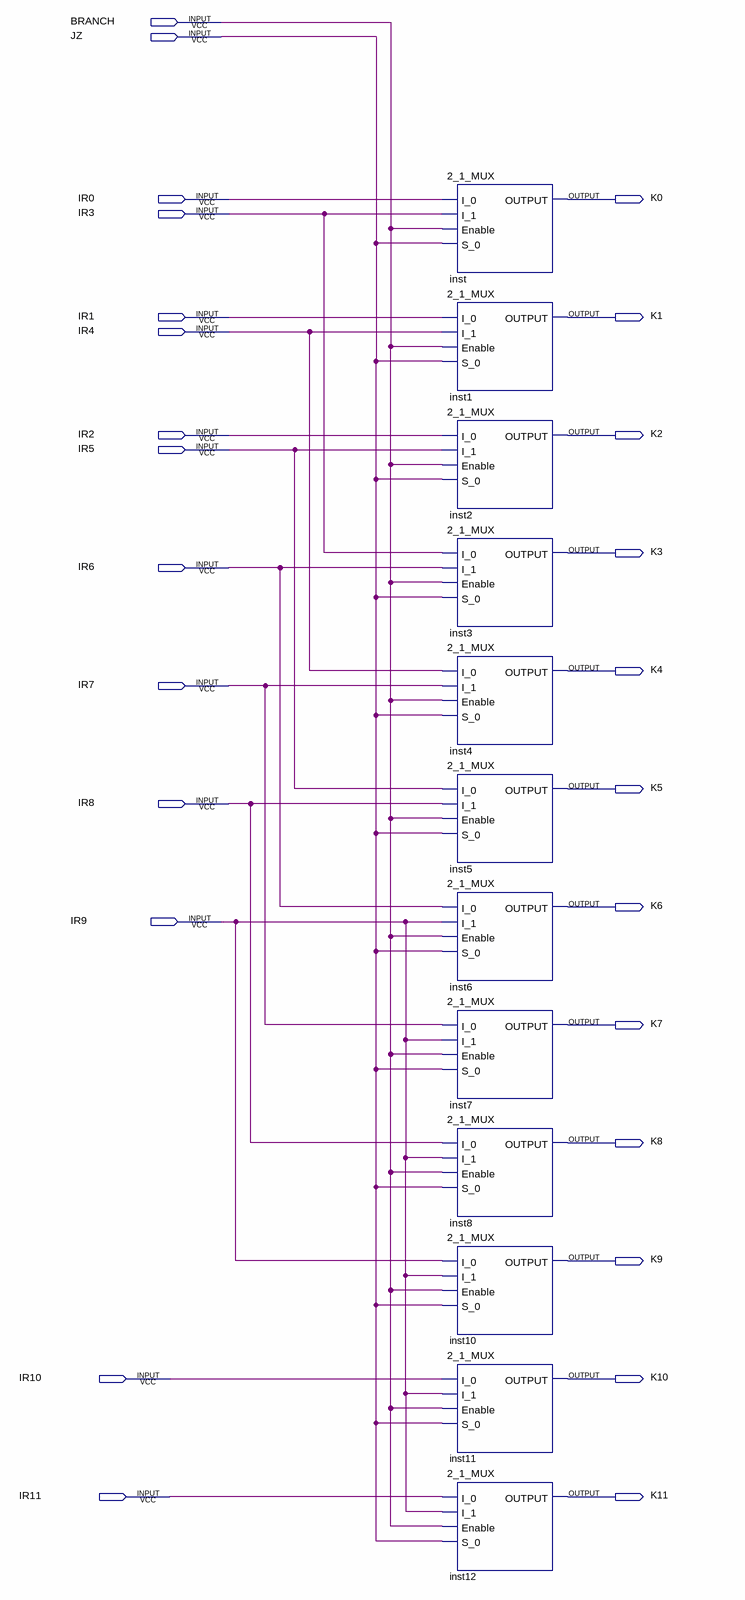
[diagram p0: schematic sheet]
// Quartus schematic JUMP_SELECT.bdf as structural Verilog: 12 symbols, 26 pins
module JUMP_SELECT (
  input  BRANCH,
  input  JZ,
  input  IR0,
  input  IR3,
  input  IR1,
  input  IR4,
  input  IR2,
  input  IR5,
  input  IR6,
  input  IR7,
  input  IR8,
  input  IR9,
  input  IR10,
  input  IR11,
  output K0,
  output K1,
  output K2,
  output K3,
  output K4,
  output K5,
  output K6,
  output K7,
  output K8,
  output K9,
  output K10,
  output K11
);

  \2_1_MUX  inst (.I_0(IR0), .I_1(IR3), .Enable(BRANCH), .S_0(JZ), .OUTPUT(K0));
  \2_1_MUX  inst1 (.I_0(IR1), .I_1(IR4), .Enable(BRANCH), .S_0(JZ), .OUTPUT(K1));
  \2_1_MUX  inst2 (.I_0(IR2), .I_1(IR5), .Enable(BRANCH), .S_0(JZ), .OUTPUT(K2));
  \2_1_MUX  inst3 (.I_0(IR3), .I_1(IR6), .Enable(BRANCH), .S_0(JZ), .OUTPUT(K3));
  \2_1_MUX  inst4 (.I_0(IR4), .I_1(IR7), .Enable(BRANCH), .S_0(JZ), .OUTPUT(K4));
  \2_1_MUX  inst5 (.I_0(IR5), .I_1(IR8), .Enable(BRANCH), .S_0(JZ), .OUTPUT(K5));
  \2_1_MUX  inst6 (.I_0(IR6), .I_1(IR9), .Enable(BRANCH), .S_0(JZ), .OUTPUT(K6));
  \2_1_MUX  inst7 (.I_0(IR7), .I_1(IR9), .Enable(BRANCH), .S_0(JZ), .OUTPUT(K7));
  \2_1_MUX  inst8 (.I_0(IR8), .I_1(IR9), .Enable(BRANCH), .S_0(JZ), .OUTPUT(K8));
  \2_1_MUX  inst10 (.I_0(IR9), .I_1(IR9), .Enable(BRANCH), .S_0(JZ), .OUTPUT(K9));
  \2_1_MUX  inst11 (.I_0(IR10), .I_1(IR9), .Enable(BRANCH), .S_0(JZ), .OUTPUT(K10));
  \2_1_MUX  inst12 (.I_0(IR11), .I_1(IR9), .Enable(BRANCH), .S_0(JZ), .OUTPUT(K11));
endmodule
